# Altium schematic sheet Periféricos.SchDoc
size A4
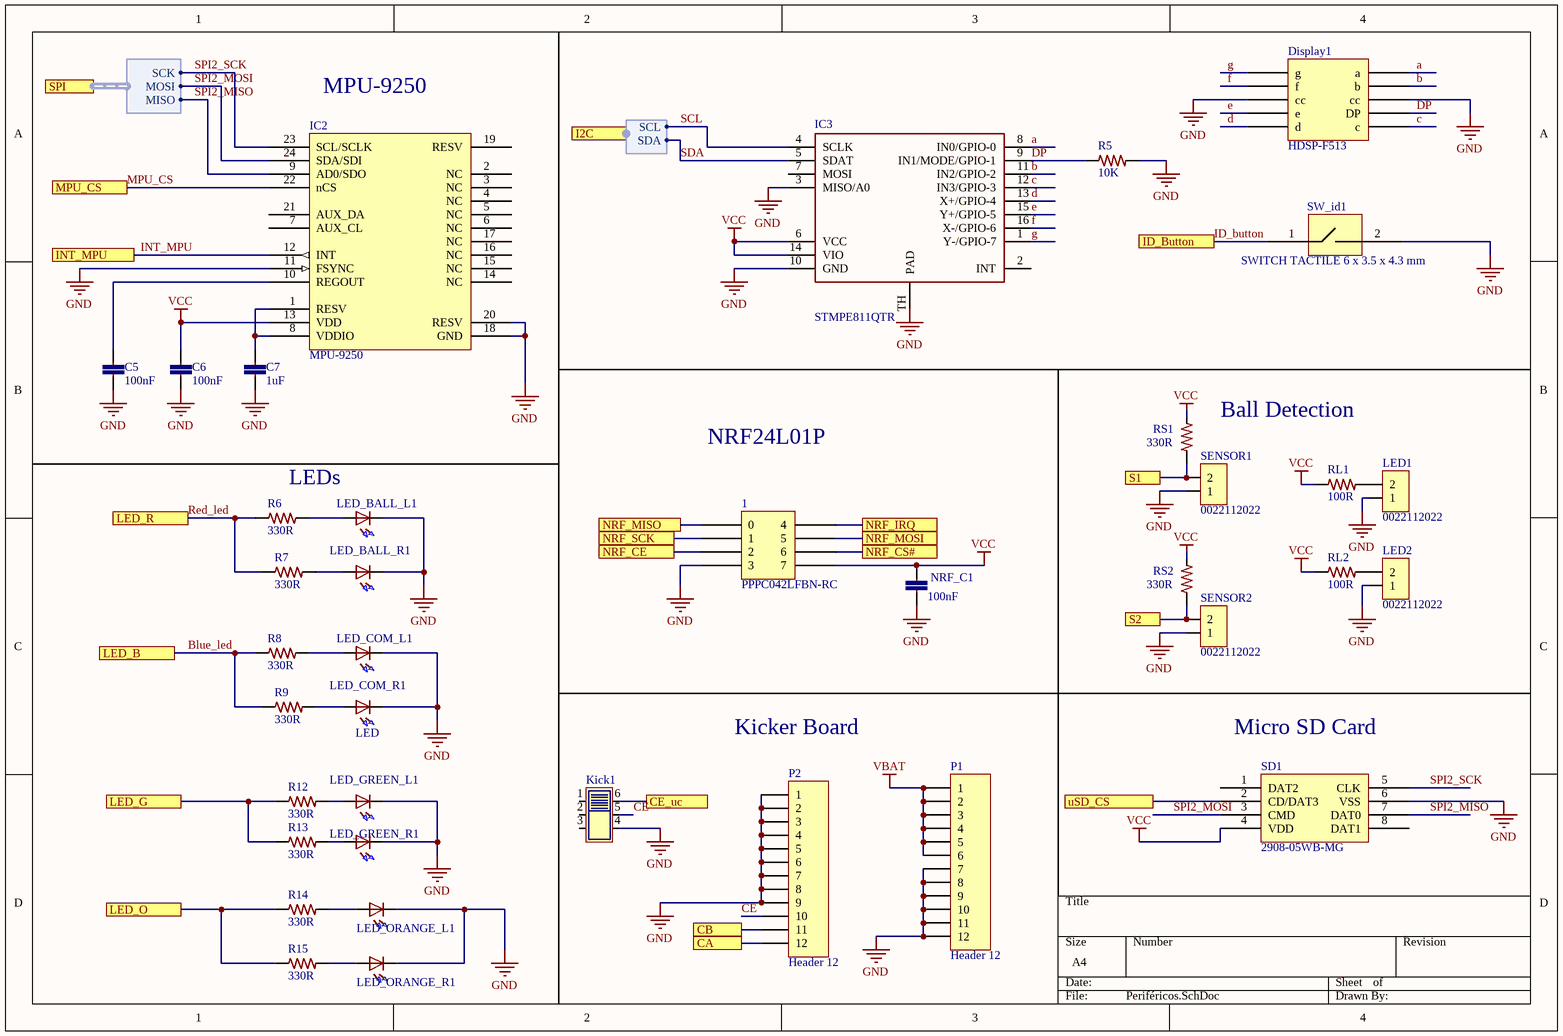
[diagram p0: Periféricos.SchDoc]

## Parts
1  PPPC042LFBN-RC  [04x02_Conector_Female]
C5  100nF  [0402-CAP]
C6  100nF  [0402-CAP]
C7  1uF  [0402-CAP]
Display1  HDSP-F513  [New footprint 1]
IC2  MPU-9250  [MPU-9250]
IC3  STMPE811QTR  [QFN16_N]
Kick1  JS202011SCQN  [SOP250P750X350-6N]  (value not drawn)
LED1  0022112022  [02x01_Conector_Male]
LED2  0022112022  [02x01_Conector_Male]
LED_BALL_L1  LED  [LED-5MM-PCB]  (value not drawn)
LED_BALL_R1  LED  [LED-5MM-PCB]  (value not drawn)
LED_COM_L1  LED  [LED-5MM-PCB]  (value not drawn)
LED_COM_R1  LED  [LED-5MM-PCB]
LED_GREEN_L1  LED  [LED-5MM-PCB]  (value not drawn)
LED_GREEN_R1  LED  [LED-5MM-PCB]  (value not drawn)
LED_ORANGE_L1  LED  [LED-5MM-PCB]  (value not drawn)
LED_ORANGE_R1  LED  [LED-5MM-PCB]  (value not drawn)
NRF_C1  100nF  [0402-CAP]
P1  Header 12  [HDR1X12]
P2  Header 12  [HDR1X12]
R5  10K  [0402-RES-HD]
R6  330R  [0402-RES-HD]
R7  330R  [0402-RES-HD]
R8  330R  [0402-RES-HD]
R9  330R  [0402-RES-HD]
R12  330R  [0402-RES-HD]
R13  330R  [0402-RES-HD]
R14  330R  [0402-RES-HD]
R15  330R  [0402-RES-HD]
RL1  100R  [0402-RES-HD]
RL2  100R  [0402-RES-HD]
RS1  330R  [0402-RES-HD]
RS2  330R  [0402-RES-HD]
SD1  2908-05WB-MG  [New footprint 1]
SENSOR1  0022112022  [02x01_Conector_Male]
SENSOR2  0022112022  [02x01_Conector_Male]
SW_id1  SWITCH TACTILE 6 x 3.5 x 4.3 mm  [PCBComponent]

## Ports
CA, CB, CE_uc, I2C (harness I2C), ID_Button, INT_MPU, LED_B, LED_G, LED_O, LED_R, MPU_CS, NRF_CE, NRF_CS#, NRF_IRQ, NRF_MISO, NRF_MOSI, NRF_SCK, S1, S2, SPI (harness SPI), uSD_CS

## Harnesses
SPI: MOSI, MISO, SCK
I2C: SCL, SDA

## Nets
GND: 1.3 C5.2 C6.2 C7.2 Display1.3(cc) Display1.8(cc) IC2.11(FSYNC) IC2.18(GND) IC2.20(RESV) IC3.3(MISO/A0) IC3.10(GND) IC3.TH(PAD) Kick1.4 LED1.1 LED2.1 LED_BALL_L1.1(K) LED_BALL_R1.1(K) LED_COM_L1.1(K) LED_COM_R1.1(K) LED_GREEN_L1.1(K) LED_GREEN_R1.1(K) LED_ORANGE_L1.1(K) LED_ORANGE_R1.1(K) NRF_C1.2 P1.7 P1.8 P1.9 P1.10 P1.11 P1.12 P2.1 P2.2 P2.3 P2.4 P2.5 P2.6 P2.7 P2.8 P2.9 R5.2 SD1.6(VSS) SENSOR1.1 SENSOR2.1 SW_id1.2
VBAT: P1.1 P1.2 P1.3 P1.4 P1.5 P1.6
VCC: 1.7 C6.1 IC2.13(VDD) IC3.6(VCC) IC3.14(VIO) NRF_C1.1 RL1.1 RL2.1 RS1.2 RS2.2 SD1.4(VDD)
a: Display1.6(a) IC3.8(IN0/GPIO-0)
b: Display1.7(b) IC3.11(IN2/GPIO-2)
Blue_led: R8.1 R9.1 ; port LED_B
c: Display1.10(c) IC3.12(IN3/GPIO-3)
CA: P2.12 ; port CA
CB: P2.11 ; port CB
CE: Kick1.5 P2.10
CE_uc: Kick1.6 ; port CE_uc
d: Display1.5(d) IC3.13(X+/GPIO-4)
DP: Display1.9(DP) IC3.9(IN1/MODE/GPIO-1) R5.1
e: Display1.4(e) IC3.15(Y+/GPIO-5)
f: Display1.2(f) IC3.16(X-/GPIO-6)
g: Display1.1(g) IC3.1(Y-/GPIO-7)
ID_button: SW_id1.1 ; port ID_Button
INT_MPU: IC2.12(INT) ; port INT_MPU
LED_G: R12.1 R13.1 ; port LED_G
LED_O: R14.1 R15.1 ; port LED_O
MPU_CS: IC2.22(nCS) ; port MPU_CS
NRF_CE: 1.2 ; port NRF_CE
NRF_CS#: 1.6 ; port NRF_CS#
NRF_IRQ: 1.4 ; port NRF_IRQ
NRF_MISO: 1.0 ; port NRF_MISO
NRF_MOSI: 1.5 ; port NRF_MOSI
NRF_SCK: 1.1 ; port NRF_SCK
Red_led: R6.1 R7.1 ; port LED_R
S1: RS1.1 SENSOR1.2 ; port S1
S2: RS2.1 SENSOR2.2 ; port S2
SCL: IC3.4(SCLK) ; port I2C.SCL
SDA: IC3.5(SDAT) ; port I2C.SDA
SPI2_MISO: IC2.9(AD0/SDO) SD1.7(DAT0) ; port SPI.MISO
SPI2_MOSI: IC2.24(SDA/SDI) SD1.3(CMD) ; port SPI.MOSI
SPI2_SCK: IC2.23(SCL/SCLK) SD1.5(CLK) ; port SPI.SCK
uSD_CS: SD1.2(CD/DAT3) ; port uSD_CS
NetC5_1: C5.1 IC2.10(REGOUT)
NetC7_1: C7.1 IC2.1(RESV) IC2.8(VDDIO)
NetLED1_2: LED1.2 RL1.2
NetLED2_2: LED2.2 RL2.2
NetLED_BALL_L1_2: LED_BALL_L1.2(A) R6.2
NetLED_BALL_R1_2: LED_BALL_R1.2(A) R7.2
NetLED_COM_L1_2: LED_COM_L1.2(A) R8.2
NetLED_COM_R1_2: LED_COM_R1.2(A) R9.2
NetLED_GREEN_L1_2: LED_GREEN_L1.2(A) R12.2
NetLED_GREEN_R1_2: LED_GREEN_R1.2(A) R13.2
NetLED_ORANGE_L1_2: LED_ORANGE_L1.2(A) R14.2
NetLED_ORANGE_R1_2: LED_ORANGE_R1.2(A) R15.2

Not connected (* = marked no-connect by the designer): IC2 2(NC) 3(NC) 4(NC) 5(NC) 6(NC) 7(AUX_CL) 14(NC) 15(NC) 16(NC) 17(NC) 19(RESV) 21(AUX_DA); IC3 2(INT) 7(MOSI); Kick1 1 2 3; SD1 1(DAT2) 8(DAT1)

## Notes on the sheet
- (near IC2) MPU-9250
- NRF24L01P
- (near RS1) Ball Detection
- LEDs
- Kicker Board
- (near SD1) Micro SD Card

## Library data of the parts
1 = 04x02_Conector_Female: 8 Position Header Connector 0.100" (2.54mm) Through Hole Gold
C5 C6 NRF_C1 = CC0402-100nF-A.12: CAP CER 0.1UF 10V 20% X5R 0402; Part No: VJ0402V104ZXQPBC; Cod EMS: 05.281.006.133; Value: 100n
C7 = CC0402-1uF-5: CAP CER 1UF 6.3V 10% X5R 0402; Part No: JMK105BJ105KV-F; Cod EMS: 05.281.019.513; Value: 1u
Display1 = HDSP-F513-01.A.2: 7 segments display
IC2 = MPU-9250-1: IMU ACCEL/GYRO/MAG I2C/SPI 24QFN; Part No: MPU-9250
IC3 = STMPE811QTR-6: IC TSC I/O EXPAND 8B 16QFN; Cod EMS: 05.284.001.511; Part No: STMPE811QTR
Kick1 = JS202011SCQN-1: SWITCH SLIDE DPDT 300MA 6V; Part No: JS202011SCQN
LED1 LED2 SENSOR1 SENSOR2 = 02x01_Conector_Male: CONN HEADER 2POS .100 VERT GOLD
LED_BALL_L1 LED_BALL_R1 LED_COM_L1 LED_COM_R1 LED_GREEN_L1 LED_GREEN_R1 LED_ORANGE_L1 LED_ORANGE_R1 = LED-5MM-3: LED 5MM PTH
P1 P2 = Header 12: Header, 12-Pin; LatestRevisionDate: 17-Jul-2002; LatestRevisionNote: Re-released for DXP Platform.; Publisher: Altium Limited
R5 = R0402-10K-11: RES 10K OHM 1/10W 1% 0402 SMD; Part No: ERJ-2RKF1002X; Cod EMS: 05.280.029.525; Family Description: RESISTOR FILME ESPESSO 10R-1M / 1/10W / 1% / 0402. P/N: ERJ-2RKF....X – PANASONIC ELECTRONIC COMPONENTS.; Value: 10K; Family: ERJ-2RKF....X
R6-R9 R12-R15 = R0402-330R-7: RES 330 OHM 1/10W 1% 0402 SMD; Part No: ERJ-2RKF3300X; Cod EMS: 05.280.029.506; Value: 330; Family Description: RESISTOR FILME ESPESSO 10R-1M / 1/10W / 1% / 0402. P/N: ERJ-2RKF....X – PANASONIC ELECTRONIC COMPONENTS.; Family: ERJ-2RKF....X
RL1 RL2 = R0402-100R-5: RES 100 OHM 1/10W 1% 0402 SMD; Part No: ERJ-2RKF1000X; Value: 100; Cod EMS: 05.280.029.519; Family Description: RESISTOR FILME ESPESSO 10R-1M / 1/10W / 1% / 0402. P/N: ERJ-2RKF....X – PANASONIC ELECTRONIC COMPONENTS.; Family: ERJ-2RKF....X
RS1 RS2 = R0402-330R-7: RES 330 OHM 1/10W 1% 0402 SMD; Part No: ERJ-2RKF3300X; Value: 330; Cod EMS: 05.280.029.506; Family Description: RESISTOR FILME ESPESSO 10R-1M / 1/10W / 1% / 0402. P/N: ERJ-2RKF....X – PANASONIC ELECTRONIC COMPONENTS.; Family: ERJ-2RKF....X
SD1 = 2908-05WB-MG-01.A.1: CONN MICRO SD CARD PUSH-PUSH R/A
SW_id1 = 95C04A3GWRT.-1: GRAYHILL TACT,GW,6X3.5,1800T&R,LF Eight, 160g Operating Force, Gull Wing, RoHS Compliant; Part No: 95C04A3GWRT